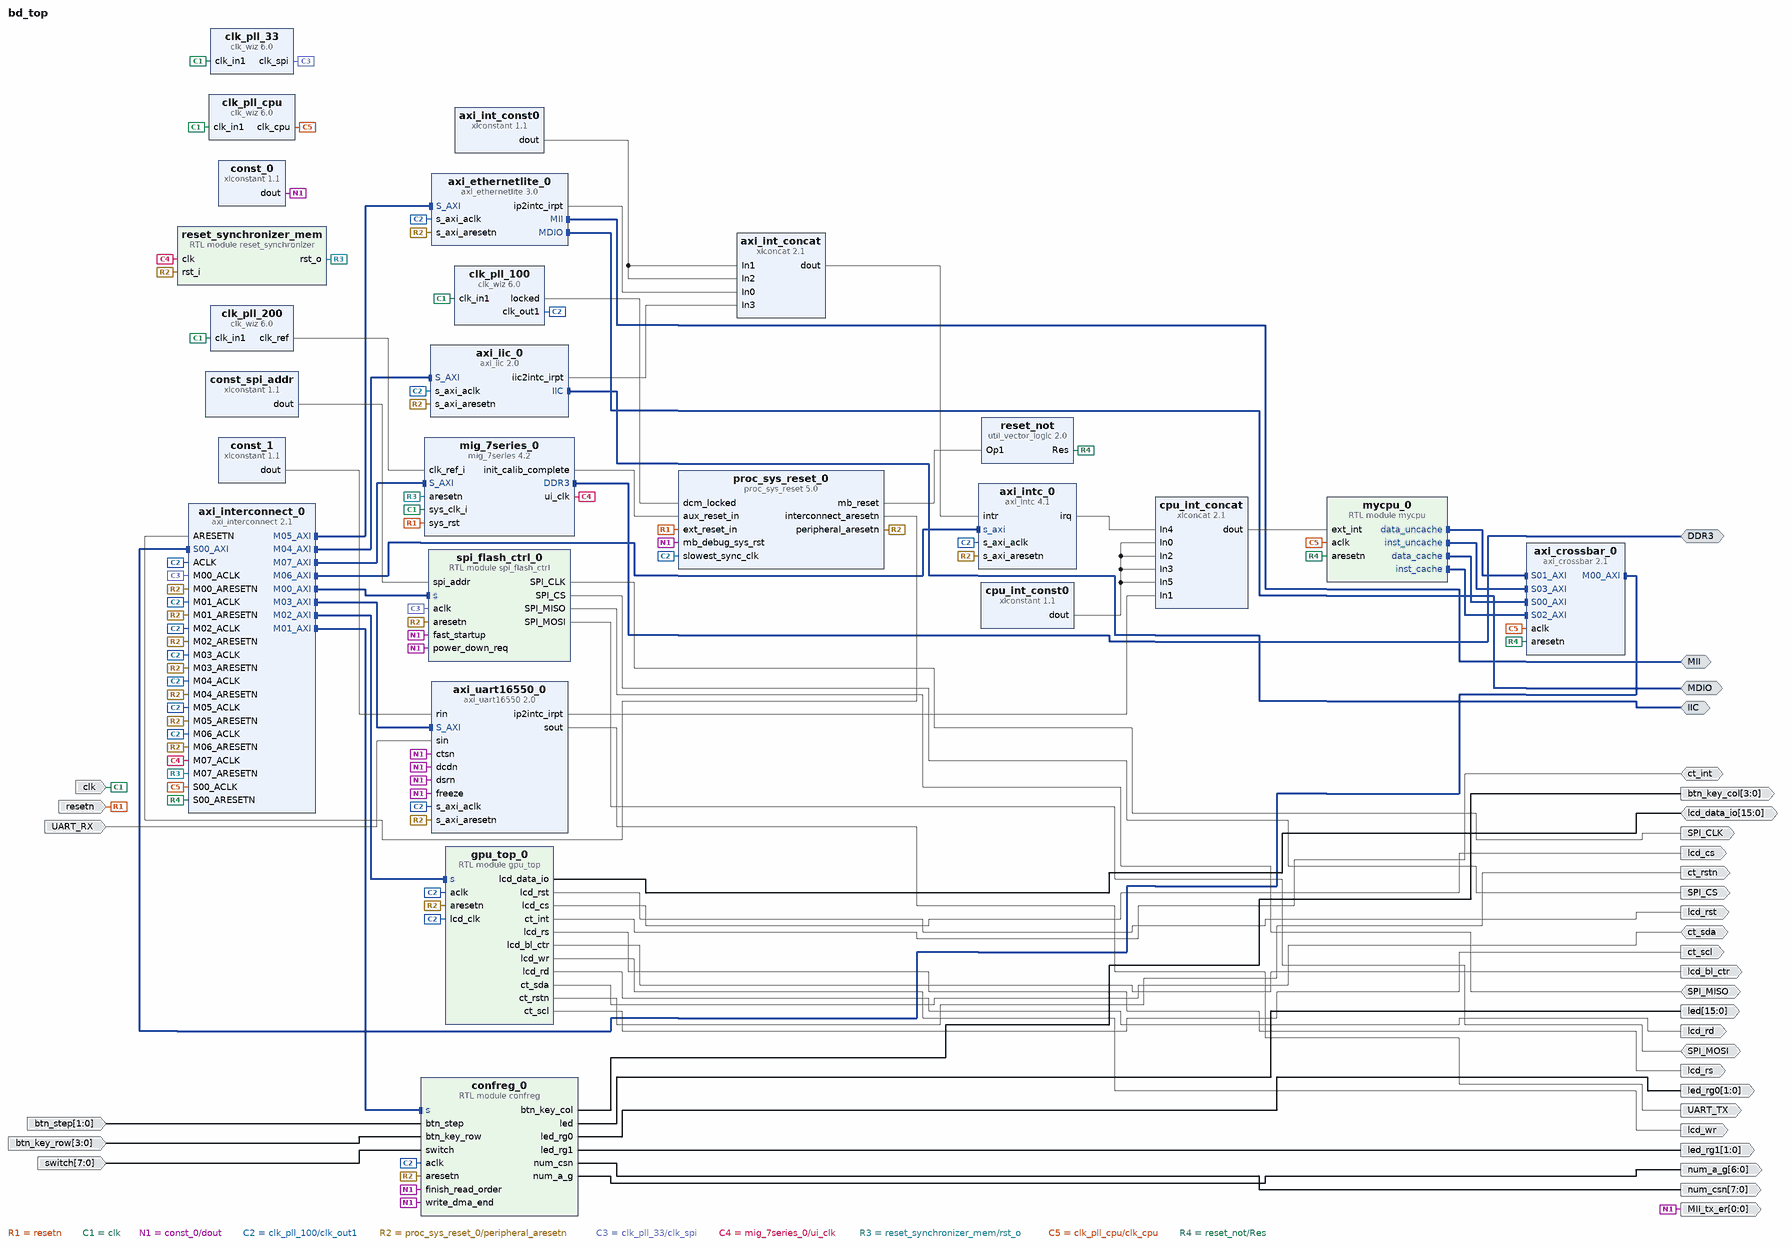
[diagram p0: block diagram of the top level]
# Vivado block design bd_top, xc7a200tfbg676-2, Vivado 2019.2
create_bd_design bd_top

create_bd_intf_port -mode Master -vlnv xilinx.com:interface:iic_rtl:1.0 IIC
create_bd_intf_port -mode Master -vlnv xilinx.com:interface:mii_rtl:1.0 MII
create_bd_intf_port -mode Master -vlnv xilinx.com:interface:mdio_rtl:1.0 MDIO
create_bd_intf_port -mode Master -vlnv xilinx.com:interface:ddrx_rtl:1.0 DDR3
create_bd_port -dir I -type clk clk
set_property -dict {CONFIG.ASSOCIATED_RESET resetn CONFIG.FREQ_HZ 100000000} [get_bd_ports clk]
create_bd_port -dir I -type rst resetn
create_bd_port -dir O -type clk SPI_CLK
create_bd_port -dir O SPI_CS
create_bd_port -dir IO SPI_MISO
create_bd_port -dir IO SPI_MOSI
create_bd_port -dir O -from 15 -to 0 led
create_bd_port -dir O -from 1 -to 0 led_rg0
create_bd_port -dir O -from 1 -to 0 led_rg1
create_bd_port -dir O -from 7 -to 0 num_csn
create_bd_port -dir O -from 6 -to 0 num_a_g
create_bd_port -dir O -from 3 -to 0 btn_key_col
create_bd_port -dir I -from 1 -to 0 btn_step
create_bd_port -dir I -from 3 -to 0 btn_key_row
create_bd_port -dir I -from 7 -to 0 switch
create_bd_port -dir IO -from 15 -to 0 lcd_data_io
create_bd_port -dir O -type rst lcd_rst
create_bd_port -dir O lcd_cs
create_bd_port -dir O lcd_rs
create_bd_port -dir O lcd_wr
create_bd_port -dir O lcd_rd
create_bd_port -dir O lcd_bl_ctr
create_bd_port -dir IO ct_int
create_bd_port -dir IO ct_sda
create_bd_port -dir O ct_scl
create_bd_port -dir O -type rst ct_rstn
create_bd_port -dir O UART_TX
create_bd_port -dir I UART_RX
create_bd_port -dir O -from 0 -to 0 MII_tx_er

create_bd_cell -type ip -vlnv xilinx.com:ip:clk_wiz:6.0 clk_pll_cpu
set_property -dict [list \
  CONFIG.CLKOUT1_DRIVES BUFG \
  CONFIG.CLKOUT1_JITTER 333.104 \
  CONFIG.CLKOUT1_PHASE_ERROR 261.747 \
  CONFIG.CLKOUT1_REQUESTED_OUT_FREQ 33.000 \
  CONFIG.CLKOUT2_DRIVES BUFG \
  CONFIG.CLKOUT3_DRIVES BUFG \
  CONFIG.CLKOUT4_DRIVES BUFG \
  CONFIG.CLKOUT5_DRIVES BUFG \
  CONFIG.CLKOUT6_DRIVES BUFG \
  CONFIG.CLKOUT7_DRIVES BUFG \
  CONFIG.CLK_OUT1_PORT clk_cpu \
  CONFIG.MMCM_BANDWIDTH OPTIMIZED \
  CONFIG.MMCM_CLKFBOUT_MULT_F 33 \
  CONFIG.MMCM_CLKOUT0_DIVIDE_F 25 \
  CONFIG.MMCM_COMPENSATION ZHOLD \
  CONFIG.MMCM_DIVCLK_DIVIDE 4 \
  CONFIG.PRIMITIVE PLL \
  CONFIG.USE_LOCKED false \
  CONFIG.USE_RESET false \
] [get_bd_cells clk_pll_cpu]
create_bd_cell -type ip -vlnv xilinx.com:ip:clk_wiz:6.0 clk_pll_33
set_property -dict [list \
  CONFIG.CLKOUT1_DRIVES BUFG \
  CONFIG.CLKOUT1_JITTER 333.104 \
  CONFIG.CLKOUT1_PHASE_ERROR 261.747 \
  CONFIG.CLKOUT1_REQUESTED_OUT_FREQ 33.000 \
  CONFIG.CLKOUT2_DRIVES BUFG \
  CONFIG.CLKOUT3_DRIVES BUFG \
  CONFIG.CLKOUT4_DRIVES BUFG \
  CONFIG.CLKOUT5_DRIVES BUFG \
  CONFIG.CLKOUT6_DRIVES BUFG \
  CONFIG.CLKOUT7_DRIVES BUFG \
  CONFIG.CLK_OUT1_PORT clk_spi \
  CONFIG.MMCM_BANDWIDTH OPTIMIZED \
  CONFIG.MMCM_CLKFBOUT_MULT_F 33 \
  CONFIG.MMCM_CLKOUT0_DIVIDE_F 25 \
  CONFIG.MMCM_COMPENSATION ZHOLD \
  CONFIG.MMCM_DIVCLK_DIVIDE 4 \
  CONFIG.PRIMITIVE PLL \
  CONFIG.USE_LOCKED false \
  CONFIG.USE_RESET false \
] [get_bd_cells clk_pll_33]
create_bd_cell -type ip -vlnv xilinx.com:ip:clk_wiz:6.0 clk_pll_200
set_property -dict [list \
  CONFIG.CLKOUT1_DRIVES BUFG \
  CONFIG.CLKOUT1_JITTER 114.829 \
  CONFIG.CLKOUT1_PHASE_ERROR 98.575 \
  CONFIG.CLKOUT1_REQUESTED_OUT_FREQ 200.000 \
  CONFIG.CLKOUT2_DRIVES BUFG \
  CONFIG.CLKOUT3_DRIVES BUFG \
  CONFIG.CLKOUT4_DRIVES BUFG \
  CONFIG.CLKOUT5_DRIVES BUFG \
  CONFIG.CLKOUT6_DRIVES BUFG \
  CONFIG.CLKOUT7_DRIVES BUFG \
  CONFIG.CLK_OUT1_PORT clk_ref \
  CONFIG.MMCM_BANDWIDTH OPTIMIZED \
  CONFIG.MMCM_CLKFBOUT_MULT_F 10 \
  CONFIG.MMCM_CLKOUT0_DIVIDE_F 5 \
  CONFIG.MMCM_COMPENSATION ZHOLD \
  CONFIG.PRIMITIVE PLL \
  CONFIG.USE_LOCKED false \
  CONFIG.USE_RESET false \
] [get_bd_cells clk_pll_200]
create_bd_cell -type ip -vlnv xilinx.com:ip:clk_wiz:6.0 clk_pll_100
set_property -dict [list \
  CONFIG.CLKOUT1_DRIVES BUFG \
  CONFIG.CLKOUT1_JITTER 137.681 \
  CONFIG.CLKOUT1_PHASE_ERROR 105.461 \
  CONFIG.CLKOUT2_DRIVES BUFG \
  CONFIG.CLKOUT3_DRIVES BUFG \
  CONFIG.CLKOUT4_DRIVES BUFG \
  CONFIG.CLKOUT5_DRIVES BUFG \
  CONFIG.CLKOUT6_DRIVES BUFG \
  CONFIG.CLKOUT7_DRIVES BUFG \
  CONFIG.MMCM_BANDWIDTH OPTIMIZED \
  CONFIG.MMCM_CLKFBOUT_MULT_F 9 \
  CONFIG.MMCM_CLKOUT0_DIVIDE_F 9 \
  CONFIG.MMCM_COMPENSATION ZHOLD \
  CONFIG.PRIMITIVE PLL \
  CONFIG.PRIM_SOURCE No_buffer \
  CONFIG.USE_RESET false \
] [get_bd_cells clk_pll_100]
create_bd_cell -type ip -vlnv xilinx.com:ip:proc_sys_reset:5.0 proc_sys_reset_0
create_bd_cell -type ip -vlnv xilinx.com:ip:axi_interconnect:2.1 axi_interconnect_0
set_property -dict {CONFIG.NUM_MI 8 CONFIG.STRATEGY 1} [get_bd_cells axi_interconnect_0]
create_bd_cell -type ip -vlnv xilinx.com:ip:axi_crossbar:2.1 axi_crossbar_0
set_property -dict [list \
  CONFIG.NUM_MI 1 \
  CONFIG.NUM_SI 4 \
  CONFIG.PROTOCOL AXI3 \
  CONFIG.S00_ARB_PRIORITY 2 \
  CONFIG.S01_ARB_PRIORITY 1 \
  CONFIG.S01_BASE_ID 0x00000010 \
  CONFIG.S02_ARB_PRIORITY 4 \
  CONFIG.S02_BASE_ID 0x00000020 \
  CONFIG.S03_ARB_PRIORITY 3 \
  CONFIG.S03_BASE_ID 0x00000030 \
  CONFIG.S04_BASE_ID 0x00000040 \
  CONFIG.S05_BASE_ID 0x00000050 \
  CONFIG.S06_BASE_ID 0x00000060 \
  CONFIG.S07_BASE_ID 0x00000070 \
  CONFIG.S08_BASE_ID 0x00000080 \
  CONFIG.S09_BASE_ID 0x00000090 \
  CONFIG.S10_BASE_ID 0x000000a0 \
  CONFIG.S11_BASE_ID 0x000000b0 \
  CONFIG.S12_BASE_ID 0x000000c0 \
  CONFIG.S13_BASE_ID 0x000000d0 \
  CONFIG.S14_BASE_ID 0x000000e0 \
  CONFIG.S15_BASE_ID 0x000000f0 \
] [get_bd_cells axi_crossbar_0]
create_bd_cell -type module -reference spi_flash_ctrl spi_flash_ctrl_0
create_bd_cell -type ip -vlnv xilinx.com:ip:xlconstant:1.1 const_spi_addr
set_property -dict {CONFIG.CONST_VAL 0x1fe8 CONFIG.CONST_WIDTH 16} [get_bd_cells const_spi_addr]
create_bd_cell -type module -reference confreg confreg_0
create_bd_cell -type module -reference gpu_top gpu_top_0
create_bd_cell -type ip -vlnv xilinx.com:ip:axi_uart16550:2.0 axi_uart16550_0
create_bd_cell -type ip -vlnv xilinx.com:ip:xlconstant:1.1 const_0
set_property -dict {CONFIG.CONST_VAL 0} [get_bd_cells const_0]
create_bd_cell -type ip -vlnv xilinx.com:ip:xlconstant:1.1 const_1
create_bd_cell -type ip -vlnv xilinx.com:ip:axi_ethernetlite:3.0 axi_ethernetlite_0
create_bd_cell -type ip -vlnv xilinx.com:ip:axi_intc:4.1 axi_intc_0
set_property -dict {CONFIG.C_IRQ_CONNECTION 1} [get_bd_cells axi_intc_0]
create_bd_cell -type ip -vlnv xilinx.com:ip:mig_7series:4.2 mig_7series_0
set_property -dict [list \
  CONFIG.BOARD_MIG_PARAM Custom \
  CONFIG.RESET_BOARD_INTERFACE Custom \
  CONFIG.XML_INPUT_FILE mig_a.prj \
] [get_bd_cells mig_7series_0]
create_bd_cell -type ip -vlnv xilinx.com:ip:axi_iic:2.0 axi_iic_0
create_bd_cell -type ip -vlnv xilinx.com:ip:util_vector_logic:2.0 reset_not
set_property -dict {CONFIG.C_OPERATION not CONFIG.C_SIZE 1} [get_bd_cells reset_not]
create_bd_cell -type module -reference reset_synchronizer reset_synchronizer_mem
create_bd_cell -type ip -vlnv xilinx.com:ip:xlconcat:2.1 cpu_int_concat
set_property -dict {CONFIG.NUM_PORTS 6} [get_bd_cells cpu_int_concat]
create_bd_cell -type ip -vlnv xilinx.com:ip:xlconcat:2.1 axi_int_concat
set_property -dict {CONFIG.NUM_PORTS 4} [get_bd_cells axi_int_concat]
create_bd_cell -type ip -vlnv xilinx.com:ip:xlconstant:1.1 cpu_int_const0
set_property -dict {CONFIG.CONST_VAL 0} [get_bd_cells cpu_int_const0]
create_bd_cell -type ip -vlnv xilinx.com:ip:xlconstant:1.1 axi_int_const0
set_property -dict {CONFIG.CONST_VAL 0} [get_bd_cells axi_int_const0]
create_bd_cell -type module -reference mycpu mycpu_0

# ---- connections ----

connect_bd_intf_net [get_bd_intf_pins confreg_0/s] [get_bd_intf_pins axi_interconnect_0/M01_AXI]
connect_bd_intf_net [get_bd_intf_pins mycpu_0/data_uncache] [get_bd_intf_pins axi_crossbar_0/S01_AXI]
connect_bd_intf_net [get_bd_intf_pins mycpu_0/inst_uncache] [get_bd_intf_pins axi_crossbar_0/S03_AXI]
connect_bd_intf_net [get_bd_intf_ports DDR3] [get_bd_intf_pins mig_7series_0/DDR3]
connect_bd_intf_net [get_bd_intf_pins axi_intc_0/s_axi] [get_bd_intf_pins axi_interconnect_0/M06_AXI]
connect_bd_intf_net [get_bd_intf_pins mig_7series_0/S_AXI] [get_bd_intf_pins axi_interconnect_0/M07_AXI]
connect_bd_intf_net [get_bd_intf_ports MII] [get_bd_intf_pins axi_ethernetlite_0/MII]
connect_bd_intf_net [get_bd_intf_pins mycpu_0/data_cache] [get_bd_intf_pins axi_crossbar_0/S00_AXI]
connect_bd_intf_net [get_bd_intf_pins axi_ethernetlite_0/S_AXI] [get_bd_intf_pins axi_interconnect_0/M05_AXI]
connect_bd_intf_net [get_bd_intf_pins gpu_top_0/s] [get_bd_intf_pins axi_interconnect_0/M02_AXI]
connect_bd_intf_net [get_bd_intf_pins spi_flash_ctrl_0/s] [get_bd_intf_pins axi_interconnect_0/M00_AXI]
connect_bd_intf_net [get_bd_intf_pins axi_iic_0/S_AXI] [get_bd_intf_pins axi_interconnect_0/M04_AXI]
connect_bd_intf_net [get_bd_intf_pins axi_uart16550_0/S_AXI] [get_bd_intf_pins axi_interconnect_0/M03_AXI]
connect_bd_intf_net [get_bd_intf_pins mycpu_0/inst_cache] [get_bd_intf_pins axi_crossbar_0/S02_AXI]
connect_bd_intf_net [get_bd_intf_ports MDIO] [get_bd_intf_pins axi_ethernetlite_0/MDIO]
connect_bd_intf_net [get_bd_intf_pins axi_crossbar_0/M00_AXI] [get_bd_intf_pins axi_interconnect_0/S00_AXI]
connect_bd_intf_net [get_bd_intf_ports IIC] [get_bd_intf_pins axi_iic_0/IIC]
connect_bd_net [get_bd_ports resetn] [get_bd_pins proc_sys_reset_0/ext_reset_in] [get_bd_pins mig_7series_0/sys_rst]
connect_bd_net [get_bd_ports clk] \
  [get_bd_pins clk_pll_33/clk_in1] [get_bd_pins clk_pll_cpu/clk_in1] [get_bd_pins clk_pll_200/clk_in1] \
  [get_bd_pins clk_pll_100/clk_in1] [get_bd_pins mig_7series_0/sys_clk_i]
connect_bd_net [get_bd_pins spi_flash_ctrl_0/SPI_CLK] [get_bd_ports SPI_CLK]
connect_bd_net [get_bd_pins spi_flash_ctrl_0/SPI_CS] [get_bd_ports SPI_CS]
connect_bd_net [get_bd_ports SPI_MISO] [get_bd_pins spi_flash_ctrl_0/SPI_MISO]
connect_bd_net [get_bd_ports SPI_MOSI] [get_bd_pins spi_flash_ctrl_0/SPI_MOSI]
connect_bd_net [get_bd_pins const_spi_addr/dout] [get_bd_pins spi_flash_ctrl_0/spi_addr]
connect_bd_net [get_bd_pins confreg_0/led] [get_bd_ports led]
connect_bd_net [get_bd_pins confreg_0/led_rg0] [get_bd_ports led_rg0]
connect_bd_net [get_bd_pins confreg_0/led_rg1] [get_bd_ports led_rg1]
connect_bd_net [get_bd_pins confreg_0/num_csn] [get_bd_ports num_csn]
connect_bd_net [get_bd_pins confreg_0/num_a_g] [get_bd_ports num_a_g]
connect_bd_net [get_bd_pins confreg_0/btn_key_col] [get_bd_ports btn_key_col]
connect_bd_net [get_bd_ports btn_step] [get_bd_pins confreg_0/btn_step]
connect_bd_net [get_bd_ports btn_key_row] [get_bd_pins confreg_0/btn_key_row]
connect_bd_net [get_bd_ports switch] [get_bd_pins confreg_0/switch]
connect_bd_net [get_bd_ports lcd_data_io] [get_bd_pins gpu_top_0/lcd_data_io]
connect_bd_net [get_bd_pins gpu_top_0/lcd_rst] [get_bd_ports lcd_rst]
connect_bd_net [get_bd_pins gpu_top_0/lcd_cs] [get_bd_ports lcd_cs]
connect_bd_net [get_bd_pins gpu_top_0/lcd_rs] [get_bd_ports lcd_rs]
connect_bd_net [get_bd_pins gpu_top_0/lcd_wr] [get_bd_ports lcd_wr]
connect_bd_net [get_bd_pins gpu_top_0/lcd_rd] [get_bd_ports lcd_rd]
connect_bd_net [get_bd_pins gpu_top_0/lcd_bl_ctr] [get_bd_ports lcd_bl_ctr]
connect_bd_net [get_bd_ports ct_int] [get_bd_pins gpu_top_0/ct_int]
connect_bd_net [get_bd_ports ct_sda] [get_bd_pins gpu_top_0/ct_sda]
connect_bd_net [get_bd_pins gpu_top_0/ct_scl] [get_bd_ports ct_scl]
connect_bd_net [get_bd_pins gpu_top_0/ct_rstn] [get_bd_ports ct_rstn]
connect_bd_net [get_bd_pins const_0/dout] \
  [get_bd_pins axi_uart16550_0/ctsn] [get_bd_pins axi_uart16550_0/dcdn] [get_bd_pins axi_uart16550_0/dsrn] \
  [get_bd_pins axi_uart16550_0/freeze] [get_bd_pins confreg_0/finish_read_order] [get_bd_pins confreg_0/write_dma_end] \
  [get_bd_pins proc_sys_reset_0/mb_debug_sys_rst] [get_bd_pins spi_flash_ctrl_0/power_down_req] \
  [get_bd_pins spi_flash_ctrl_0/fast_startup] [get_bd_ports MII_tx_er]
connect_bd_net [get_bd_pins const_1/dout] [get_bd_pins axi_uart16550_0/rin]
connect_bd_net [get_bd_pins axi_uart16550_0/sout] [get_bd_ports UART_TX]
connect_bd_net [get_bd_ports UART_RX] [get_bd_pins axi_uart16550_0/sin]
connect_bd_net [get_bd_pins clk_pll_100/clk_out1] \
  [get_bd_pins proc_sys_reset_0/slowest_sync_clk] [get_bd_pins axi_interconnect_0/ACLK] [get_bd_pins confreg_0/aclk] \
  [get_bd_pins axi_interconnect_0/M02_ACLK] [get_bd_pins axi_interconnect_0/M03_ACLK] [get_bd_pins gpu_top_0/aclk] \
  [get_bd_pins gpu_top_0/lcd_clk] [get_bd_pins axi_uart16550_0/s_axi_aclk] [get_bd_pins axi_interconnect_0/M04_ACLK] \
  [get_bd_pins axi_iic_0/s_axi_aclk] [get_bd_pins axi_interconnect_0/M05_ACLK] [get_bd_pins axi_ethernetlite_0/s_axi_aclk] \
  [get_bd_pins axi_intc_0/s_axi_aclk] [get_bd_pins axi_interconnect_0/M06_ACLK] [get_bd_pins axi_interconnect_0/M01_ACLK]
connect_bd_net [get_bd_pins clk_pll_100/locked] [get_bd_pins proc_sys_reset_0/dcm_locked]
connect_bd_net [get_bd_pins mig_7series_0/init_calib_complete] [get_bd_pins proc_sys_reset_0/aux_reset_in]
connect_bd_net [get_bd_pins proc_sys_reset_0/peripheral_aresetn] \
  [get_bd_pins axi_interconnect_0/M01_ARESETN] [get_bd_pins spi_flash_ctrl_0/aresetn] [get_bd_pins confreg_0/aresetn] \
  [get_bd_pins gpu_top_0/aresetn] [get_bd_pins axi_uart16550_0/s_axi_aresetn] [get_bd_pins axi_iic_0/s_axi_aresetn] \
  [get_bd_pins axi_ethernetlite_0/s_axi_aresetn] [get_bd_pins axi_intc_0/s_axi_aresetn] \
  [get_bd_pins reset_synchronizer_mem/rst_i] [get_bd_pins axi_interconnect_0/M02_ARESETN] \
  [get_bd_pins axi_interconnect_0/M03_ARESETN] [get_bd_pins axi_interconnect_0/M04_ARESETN] \
  [get_bd_pins axi_interconnect_0/M05_ARESETN] [get_bd_pins axi_interconnect_0/M06_ARESETN] \
  [get_bd_pins axi_interconnect_0/M00_ARESETN]
connect_bd_net [get_bd_pins proc_sys_reset_0/interconnect_aresetn] [get_bd_pins axi_interconnect_0/ARESETN]
connect_bd_net -net M01_ACLK_1 [get_bd_pins clk_pll_33/clk_spi] [get_bd_pins spi_flash_ctrl_0/aclk] [get_bd_pins axi_interconnect_0/M00_ACLK]
connect_bd_net [get_bd_pins mig_7series_0/ui_clk] [get_bd_pins reset_synchronizer_mem/clk] [get_bd_pins axi_interconnect_0/M07_ACLK]
connect_bd_net [get_bd_pins proc_sys_reset_0/mb_reset] [get_bd_pins reset_not/Op1]
connect_bd_net -net M03_ARESETN_1 [get_bd_pins reset_synchronizer_mem/rst_o] \
  [get_bd_pins mig_7series_0/aresetn] [get_bd_pins axi_interconnect_0/M07_ARESETN]
connect_bd_net [get_bd_pins clk_pll_200/clk_ref] [get_bd_pins mig_7series_0/clk_ref_i]
connect_bd_net [get_bd_pins clk_pll_cpu/clk_cpu] \
  [get_bd_pins axi_crossbar_0/aclk] [get_bd_pins axi_interconnect_0/S00_ACLK] [get_bd_pins mycpu_0/aclk]
connect_bd_net [get_bd_pins reset_not/Res] \
  [get_bd_pins axi_crossbar_0/aresetn] [get_bd_pins axi_interconnect_0/S00_ARESETN] [get_bd_pins mycpu_0/aresetn]
connect_bd_net [get_bd_pins cpu_int_concat/dout] [get_bd_pins mycpu_0/ext_int]
connect_bd_net [get_bd_pins axi_int_concat/dout] [get_bd_pins axi_intc_0/intr]
connect_bd_net [get_bd_pins axi_intc_0/irq] [get_bd_pins cpu_int_concat/In4]
connect_bd_net [get_bd_pins axi_uart16550_0/ip2intc_irpt] [get_bd_pins cpu_int_concat/In1]
connect_bd_net [get_bd_pins cpu_int_const0/dout] \
  [get_bd_pins cpu_int_concat/In0] [get_bd_pins cpu_int_concat/In2] [get_bd_pins cpu_int_concat/In3] \
  [get_bd_pins cpu_int_concat/In5]
connect_bd_net [get_bd_pins axi_ethernetlite_0/ip2intc_irpt] [get_bd_pins axi_int_concat/In0]
connect_bd_net [get_bd_pins axi_int_const0/dout] [get_bd_pins axi_int_concat/In1] [get_bd_pins axi_int_concat/In2]
connect_bd_net [get_bd_pins axi_iic_0/iic2intc_irpt] [get_bd_pins axi_int_concat/In3]

# ---- address map ----
assign_bd_address -offset 0x00000000 -range 128M -target_address_space [get_bd_addr_spaces mycpu_0/data_cache] [get_bd_addr_segs mig_7series_0/memmap/memaddr]
assign_bd_address -offset 0x1D000000 -range 64K -target_address_space [get_bd_addr_spaces mycpu_0/data_cache] [get_bd_addr_segs axi_intc_0/S_AXI/Reg]
assign_bd_address -offset 0x1FA00000 -range 1M -target_address_space [get_bd_addr_spaces mycpu_0/data_cache] [get_bd_addr_segs gpu_top_0/s/reg0]
assign_bd_address -offset 0x1FB00000 -range 64K -target_address_space [get_bd_addr_spaces mycpu_0/data_cache] [get_bd_addr_segs axi_iic_0/S_AXI/Reg]
assign_bd_address -offset 0x1FC00000 -range 1M -target_address_space [get_bd_addr_spaces mycpu_0/data_cache] [get_bd_addr_segs spi_flash_ctrl_0/s/reg0]
assign_bd_address -offset 0x1FD00000 -range 64K -target_address_space [get_bd_addr_spaces mycpu_0/data_cache] [get_bd_addr_segs confreg_0/s/reg0]
assign_bd_address -offset 0x1FE40000 -range 64K -target_address_space [get_bd_addr_spaces mycpu_0/data_cache] [get_bd_addr_segs axi_uart16550_0/S_AXI/Reg]
assign_bd_address -offset 0x1FF00000 -range 64K -target_address_space [get_bd_addr_spaces mycpu_0/data_cache] [get_bd_addr_segs axi_ethernetlite_0/S_AXI/Reg]
assign_bd_address -offset 0x00000000 -range 128M -target_address_space [get_bd_addr_spaces mycpu_0/data_uncache] [get_bd_addr_segs mig_7series_0/memmap/memaddr]
assign_bd_address -offset 0x1D000000 -range 64K -target_address_space [get_bd_addr_spaces mycpu_0/data_uncache] [get_bd_addr_segs axi_intc_0/S_AXI/Reg]
assign_bd_address -offset 0x1FA00000 -range 1M -target_address_space [get_bd_addr_spaces mycpu_0/data_uncache] [get_bd_addr_segs gpu_top_0/s/reg0]
assign_bd_address -offset 0x1FB00000 -range 64K -target_address_space [get_bd_addr_spaces mycpu_0/data_uncache] [get_bd_addr_segs axi_iic_0/S_AXI/Reg]
assign_bd_address -offset 0x1FC00000 -range 1M -target_address_space [get_bd_addr_spaces mycpu_0/data_uncache] [get_bd_addr_segs spi_flash_ctrl_0/s/reg0]
assign_bd_address -offset 0x1FD00000 -range 64K -target_address_space [get_bd_addr_spaces mycpu_0/data_uncache] [get_bd_addr_segs confreg_0/s/reg0]
assign_bd_address -offset 0x1FE40000 -range 64K -target_address_space [get_bd_addr_spaces mycpu_0/data_uncache] [get_bd_addr_segs axi_uart16550_0/S_AXI/Reg]
assign_bd_address -offset 0x1FF00000 -range 64K -target_address_space [get_bd_addr_spaces mycpu_0/data_uncache] [get_bd_addr_segs axi_ethernetlite_0/S_AXI/Reg]
assign_bd_address -offset 0x00000000 -range 128M -target_address_space [get_bd_addr_spaces mycpu_0/inst_cache] [get_bd_addr_segs mig_7series_0/memmap/memaddr]
assign_bd_address -offset 0x1D000000 -range 64K -target_address_space [get_bd_addr_spaces mycpu_0/inst_cache] [get_bd_addr_segs axi_intc_0/S_AXI/Reg]
assign_bd_address -offset 0x1FA00000 -range 1M -target_address_space [get_bd_addr_spaces mycpu_0/inst_cache] [get_bd_addr_segs gpu_top_0/s/reg0]
assign_bd_address -offset 0x1FB00000 -range 64K -target_address_space [get_bd_addr_spaces mycpu_0/inst_cache] [get_bd_addr_segs axi_iic_0/S_AXI/Reg]
assign_bd_address -offset 0x1FC00000 -range 1M -target_address_space [get_bd_addr_spaces mycpu_0/inst_cache] [get_bd_addr_segs spi_flash_ctrl_0/s/reg0]
assign_bd_address -offset 0x1FD00000 -range 64K -target_address_space [get_bd_addr_spaces mycpu_0/inst_cache] [get_bd_addr_segs confreg_0/s/reg0]
assign_bd_address -offset 0x1FE40000 -range 64K -target_address_space [get_bd_addr_spaces mycpu_0/inst_cache] [get_bd_addr_segs axi_uart16550_0/S_AXI/Reg]
assign_bd_address -offset 0x1FF00000 -range 64K -target_address_space [get_bd_addr_spaces mycpu_0/inst_cache] [get_bd_addr_segs axi_ethernetlite_0/S_AXI/Reg]
assign_bd_address -offset 0x00000000 -range 128M -target_address_space [get_bd_addr_spaces mycpu_0/inst_uncache] [get_bd_addr_segs mig_7series_0/memmap/memaddr]
assign_bd_address -offset 0x1D000000 -range 64K -target_address_space [get_bd_addr_spaces mycpu_0/inst_uncache] [get_bd_addr_segs axi_intc_0/S_AXI/Reg]
assign_bd_address -offset 0x1FA00000 -range 1M -target_address_space [get_bd_addr_spaces mycpu_0/inst_uncache] [get_bd_addr_segs gpu_top_0/s/reg0]
assign_bd_address -offset 0x1FB00000 -range 64K -target_address_space [get_bd_addr_spaces mycpu_0/inst_uncache] [get_bd_addr_segs axi_iic_0/S_AXI/Reg]
assign_bd_address -offset 0x1FC00000 -range 1M -target_address_space [get_bd_addr_spaces mycpu_0/inst_uncache] [get_bd_addr_segs spi_flash_ctrl_0/s/reg0]
assign_bd_address -offset 0x1FD00000 -range 64K -target_address_space [get_bd_addr_spaces mycpu_0/inst_uncache] [get_bd_addr_segs confreg_0/s/reg0]
assign_bd_address -offset 0x1FE40000 -range 64K -target_address_space [get_bd_addr_spaces mycpu_0/inst_uncache] [get_bd_addr_segs axi_uart16550_0/S_AXI/Reg]
assign_bd_address -offset 0x1FF00000 -range 64K -target_address_space [get_bd_addr_spaces mycpu_0/inst_uncache] [get_bd_addr_segs axi_ethernetlite_0/S_AXI/Reg]

validate_bd_design
save_bd_design
